# Altium project MAX038.PrjPcb
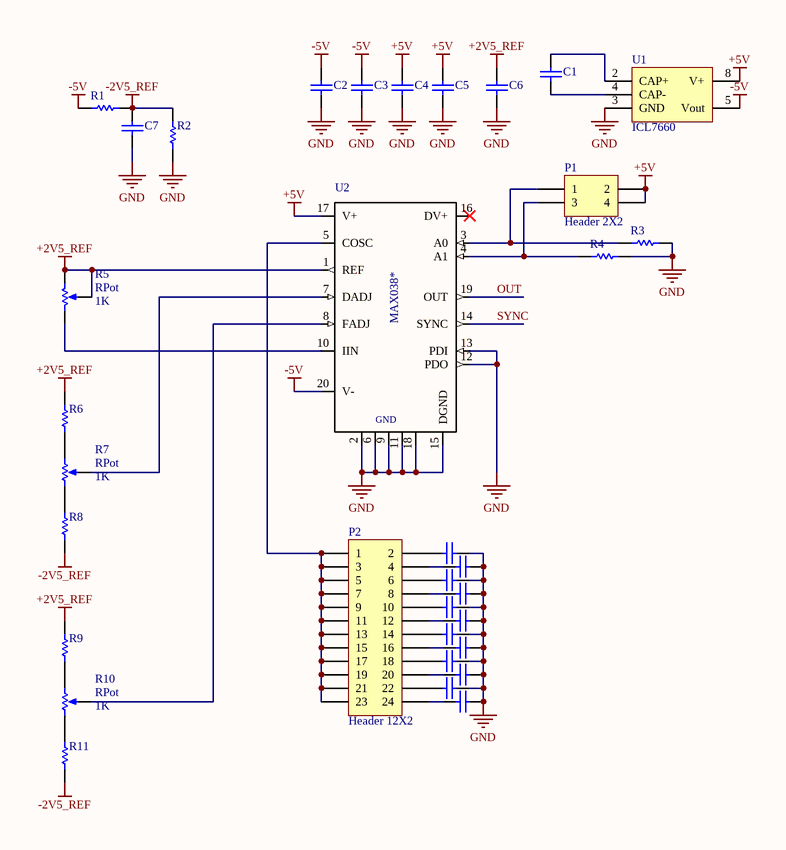
[diagram p0: sch.SchDoc]
1 sheet, 34 parts. Net scope: global (net labels, ports and power ports of the same name join across sheets).
Board file: pcb.PcbDoc

## Sheet sch.SchDoc
size A4

### Parts
C1  4700pF 100V  [RC_0805_T1.1]  (value not drawn)
C2  4700pF 100V  [RC_0805_T1.1]  (value not drawn)
C3  4700pF 100V  [RC_0805_T1.1]  (value not drawn)
C4  4700pF 100V  [RC_0805_T1.1]  (value not drawn)
C5  4700pF 100V  [RC_0805_T1.1]  (value not drawn)
C6  4700pF 100V  [RC_0805_T1.1]  (value not drawn)
C7  4700pF 100V  [RC_0805_T1.1]  (value not drawn)
C8  Cap  [RC_0805_T0.8]  (value not drawn)
C9  Cap  [RC_0805_T0.8]  (value not drawn)
C10  Cap  [RC_0805_T0.8]  (value not drawn)
C11  Cap  [RC_0805_T0.8]  (value not drawn)
C12  Cap  [RC_0805_T0.8]  (value not drawn)
C13  Cap  [RC_0805_T0.8]  (value not drawn)
C14  Cap  [RC_0805_T0.8]  (value not drawn)
C15  Cap  [RC_0805_T0.8]  (value not drawn)
C16  Cap  [RC_0805_T0.8]  (value not drawn)
C17  Cap  [RC_0805_T0.8]  (value not drawn)
C18  Cap  [RC_0805_T0.8]  (value not drawn)
C19  Cap  [RC_0805_T0.8]  (value not drawn)
P1  Header 2X2  [HDR2X2]
P2  Header 12X2  [HDR2X12]
R1  (no value)  [RR_0805]
R2  (no value)  [RR_0805]
R3  (no value)  [RR_0805]
R4  (no value)  [RR_0805]
R5  RPot  value 1K  [R_POT_16K1]
R6  (no value)  [RR_0805]
R7  RPot  value 1K  [R_POT_16K1]
R8  (no value)  [RR_0805]
R9  (no value)  [RR_0805]
R10  RPot  value 1K  [R_POT_16K1]
R11  (no value)  [RR_0805]
U1  ICL7660  [RR_SO-8]
U2  MAX038*

### Nets
+2V5_REF: C6.2 R5.1(TOP) R5.3(TAP) R6.2 R9.2 U2.1(REF)
+5V: C4.2 C5.2 P1.2 P1.4 U1.8(V+) U2.17(V+)
-2V5_REF: C7.2 R1.2 R2.2 R8.1 R11.1
-5V: C2.2 C3.2 R1.1 U1.5(Vout) U2.20(V-)
GND: C2.1 C3.1 C4.1 C5.1 C6.1 C7.1 C8.2 C9.2 C10.2 C11.2 C12.2 C13.2 C14.2 C15.2 C16.2 C17.2 C18.2 C19.2 R2.1 R3.2 R4.2 U1.3(GND) U2.2(GND) U2.6(GND@1) U2.9(GND@2) U2.11(GND@3) U2.12(PDO) U2.13(PDI) U2.15(DGND) U2.18(GND@4)
OUT: U2.19(OUT)
SYNC: U2.14(SYNC)
NetC1_1: C1.1 U1.4(CAP-)
NetC1_2: C1.2 U1.2(CAP+)
NetC8_1: C8.1 P2.2
NetC9_1: C9.1 P2.4
NetC10_1: C10.1 P2.6
NetC11_1: C11.1 P2.8
NetC12_1: C12.1 P2.10
NetC13_1: C13.1 P2.12
NetC14_1: C14.1 P2.14
NetC15_1: C15.1 P2.16
NetC16_1: C16.1 P2.18
NetC17_1: C17.1 P2.20
NetC18_1: C18.1 P2.22
NetC19_1: C19.1 P2.24
NetP1_1: P1.1 R3.1 U2.3(A0)
NetP1_3: P1.3 R4.1 U2.4(A1)
NetP2_1: P2.1 P2.3 P2.5 P2.7 P2.9 P2.11 P2.13 P2.15 P2.17 P2.19 P2.21 P2.23 U2.5(COSC)
NetR5_2: R5.2(BOT) U2.10(IIN)
NetR6_1: R6.1 R7.2(BOT)
NetR7_1: R7.1(TOP) R8.2
NetR7_3: R7.3(TAP) U2.7(DADJ)
NetR9_1: R9.1 R10.2(BOT)
NetR10_1: R10.1(TOP) R11.2
NetR10_3: R10.3(TAP) U2.8(FADJ)

Not connected (* = marked no-connect by the designer): U2 16(DV+)*

### Library data of the parts
C1-C7 = CAP-0805-472-100V: CAPACITOR CHIP; Manufacturer: AVX Corporation; Value: CAP CER 4700PF 50V X7R 0805; Order Number: 08055C472KAZ2A; Cost: 0,4; Package: 0805
C8-C19 = Cap: Capacitor; Value: 100pF; Published: 8-Jun-2000; LatestRevisionDate: 17-Jul-2002; LatestRevisionNote: Re-released for DXP Platform.; PackageReference: RAD-0.3; Publisher: Altium Limited; PackageDescription: Radial Cap, Thru-Hole; 2 Leads; 0.3 in Pin Spacing
P1 = Header 2X2: Header, 2-Pin, Dual row; LatestRevisionDate: 17-Jul-2002; LatestRevisionNote: Re-released for DXP Platform.; Publisher: Altium Limited
P2 = Header 12X2: Header, 12-Pin, Dual row; LatestRevisionDate: 17-Jul-2002; LatestRevisionNote: Re-released for DXP Platform.; Publisher: Altium Limited
R1-R4 R6 R8 R9 R11 = RES-0805-60R4-0.1%: RESISTOR; Manufacturer: CAP CER 4700PF 50V X7R 0805; Order Number: ERA-6AEB60R4V; Value: RES SMD 60.4 OHM 0.1% 1/8W 0805; Cost: 0,36; Package: 0805
R5 R7 R10 = RPot: Potentiometer; Sim Note: Enter the Resistance value and the set point into parameter fields.; Set Position: 0.5; Published: 8-Jun-2000; LatestRevisionDate: 17-Jul-2002; LatestRevisionNote: Re-released for DXP Platform.; PackageReference: VR5; Publisher: Altium Limited; PackageDescription: Variable Resistor, Thru-Hole; 3 Leads
U2 = MAX038*: Integrated Circuit; MP: MAX038; MF: Maxim Integrated; Package: DIP-20 Maxim Integrated; Price: None; SnapEDA_Link: https://www.snapeda.com/parts/MAX038/Maxim%20Integrated/view-part/?ref=snap; Availability: Unavailable; Value: *